# EAGLE design Adafruit AT42QT1070 Breakout (EAGLE 6.3)
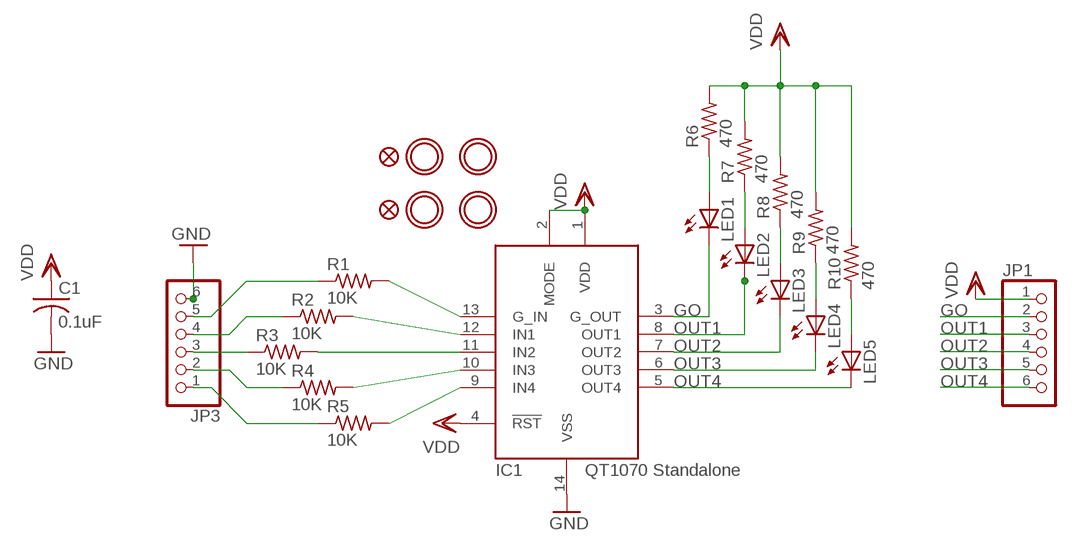
[diagram p0: schematic, sheet 1]

## Parts
C1  0.1uF  C-USC0805K  [C0805K]
FID1  FIDUCIAL""  [FIDUCIAL_1MM]
FID2  FIDUCIAL""  [FIDUCIAL_1MM]
IC1  AT42QT1070-SSU  [SO14]
JP1  PINHD-1X6CB  [1X06-CLEANBIG]
JP3  PINHD-1X6CB  [1X06-CLEANBIG]
LED1  LEDCHIP-LED0805  [CHIP-LED0805]
LED2  LEDCHIP-LED0805  [CHIP-LED0805]
LED3  LEDCHIP-LED0805  [CHIP-LED0805]
LED4  LEDCHIP-LED0805  [CHIP-LED0805]
LED5  LEDCHIP-LED0805  [CHIP-LED0805]
R1  10K  R-US_R0805  [R0805]
R2  10K  R-US_R0805  [R0805]
R3  10K  R-US_R0805  [R0805]
R4  10K  R-US_R0805  [R0805]
R5  10K  R-US_R0805  [R0805]
R6  470  R-US_R0805  [R0805]
R7  470  R-US_R0805  [R0805]
R8  470  R-US_R0805  [R0805]
R9  470  R-US_R0805  [R0805]
R10  470  R-US_R0805  [R0805]
U$1  MOUNTINGHOLE2.5  [MOUNTINGHOLE_2.5_PLATED]
U$2  MOUNTINGHOLE2.5  [MOUNTINGHOLE_2.5_PLATED]
U$3  MOUNTINGHOLE2.5  [MOUNTINGHOLE_2.5_PLATED]
U$4  MOUNTINGHOLE2.5  [MOUNTINGHOLE_2.5_PLATED]

## Nets
GND: C1.2 IC1.14(VSS) JP3.6
GO: IC1.3(G_OUT) JP1.2 LED1.C
N$1: IC1.13(G_IN) R1.2
N$2: IC1.12(IN1) R2.2
N$3: IC1.11(IN2) R3.2
N$4: IC1.10(IN3) R4.2
N$5: IC1.9(IN4) R5.2
N$6: JP3.5 R1.1
N$7: JP3.4 R2.1
N$8: JP3.3 R3.1
N$9: JP3.2 R4.1
N$10: JP3.1 R5.1
N$11: LED1.A R6.1
N$12: LED2.A R7.1
N$13: LED3.A R8.1
N$14: LED4.A R9.1
N$15: LED5.A R10.1
OUT1: IC1.8(OUT1) JP1.3 LED2.C
OUT2: IC1.7(OUT2) JP1.4 LED3.C
OUT3: IC1.6(OUT3) JP1.5 LED4.C
OUT4: IC1.5(OUT4) JP1.6 LED5.C
VDD: C1.1 IC1.1(VDD) IC1.2(MODE) IC1.4(!RST) JP1.1 R6.2 R7.2 R8.2 R9.2 R10.2

## Library data of the parts
C1 = rcl:C-US: CAPACITOR, American symbol
FID1 FID2 = microbuilder:FIDUCIAL: Fiducial Alignment Points Various fiducial points for machine vision alignment.
IC1 = adafruit:AT42QT1070: QTouch 5-channel standalone sensor IC AT42QT1070 in standalone mode has 5 inputs (guard + 4 key) and open drain outputs. 1.8V-5.5V power.
JP1 JP3 = adafruit:PINHD-1X6: PIN HEADER
LED1-LED5 = led:LED: LED OSRAM: - CHIPLED LG R971, LG N971, LY N971, LG Q971, LY Q971, LO R971, LY R971 LH N974, LH R974 LS Q976, LO Q976, LY Q976 LO Q996 - Hyper CHIPLED LW Q18S LB Q993, LB Q99A, LB R99A - SideLED LS A670, LO A670, LY A670, LG A670, LP A670 LB A673, LV A673, LT A673, LW A673 LH A674 LY A675 LS A676, LA A676, LO A676, LY A676, LW A676 LS A679, LY A679, LG A679 - Hyper Micro SIDELED® LS Y876, LA Y876, LO Y876, LY Y876 LT Y87S - SmartLED LW L88C, LW L88S LB L89C, LB L89S, LG L890 LS L89K, LO L89K, LY L89K LS L896, LA L896, LO L896, LY L896 - TOPLED LS T670, LO T670, LY T670, LG T670, LP T670 LSG T670, LSP T670, LSY T670, LOP T670, LYG T670 LG T671, LOG T671, LSG T671 LB T673, LV T673, LT T673, LW T673 LH T674 LS T676, LA T676, LO T676, LY T676, LB T676, LH T676, LSB T676, LW T676 LB T67C, LV T67C, LT T67C, LS T67K, LO T67K, LY T67K, LW E67C LS E67B, LA E67B, LO E67B, LY E67B, LB E67C, LV E67C, LT E67C LW T67C LS T679, LY T679, LG T679 LS T770, LO T770, LY T770, LG T770, LP T770 LB T773, LV T773, LT T773, LW T773 LH T774 LS E675, LA E675, LY E675, LS T675 LS T776, LA T776, LO T776, LY T776, LB T776 LHGB T686 LT T68C, LB T68C - Hyper Mini TOPLED® LB M676 - Mini TOPLED Santana® LG M470 LS M47K, LO M47K, LY M47K Source: http://www.osram.convergy.de LUXEON: - LUMILED® LXK2-PW12-R00, LXK2-PW12-S00, LXK2-PW14-U00, LXK2-PW14-V00 LXK2-PM12-R00, LXK2-PM12-S00, LXK2-PM14-U00 LXK2-PE12-Q00, LXK2-PE12-R00, LXK2-PE12-S00, LXK2-PE14-T00, LXK2-PE14-U00 LXK2-PB12-K00, LXK2-PB12-L00, LXK2-PB12-M00, LXK2-PB14-N00, LXK2-PB14-P00, LXK2-PB14-Q00 LXK2-PR12-L00, LXK2-PR12-M00, LXK2-PR14-Q00, LXK2-PR14-R00 LXK2-PD12-Q00, LXK2-PD12-R00, LXK2-PD12-S00 LXK2-PH12-R00, LXK2-PH12-S00 LXK2-PL12-P00, LXK2-PL12-Q00, LXK2-PL12-R00 Source: www.luxeon.com KINGBRIGHT: KA-3528ASYC Source: www.kingbright.com
R1-R10 = rcl:R-US_: RESISTOR, American symbol
U$1-U$4 = microbuilder:MOUNTINGHOLE: Mounting Hole For #2 screws (0.086"/2.18mm width, 0.094"/2.4mm hole) use 2.5mm

## Board
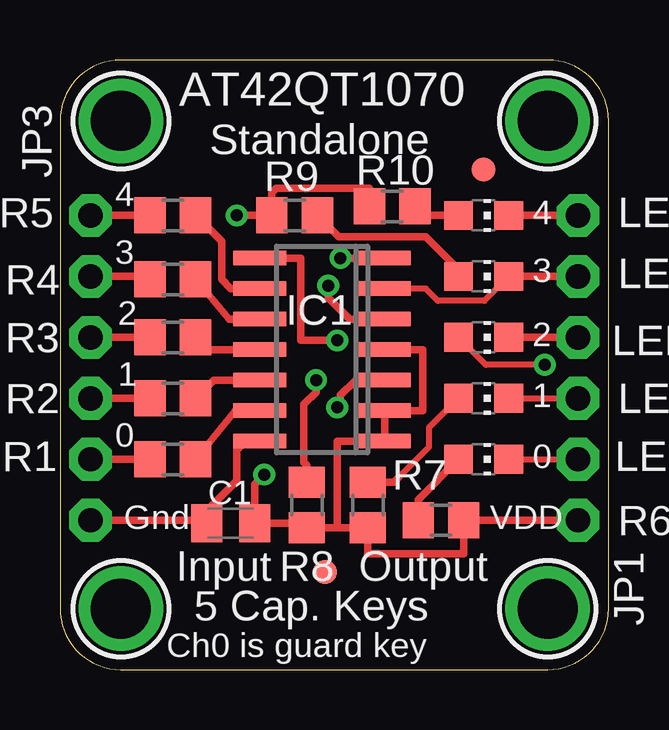
[diagram p1: board, top side]
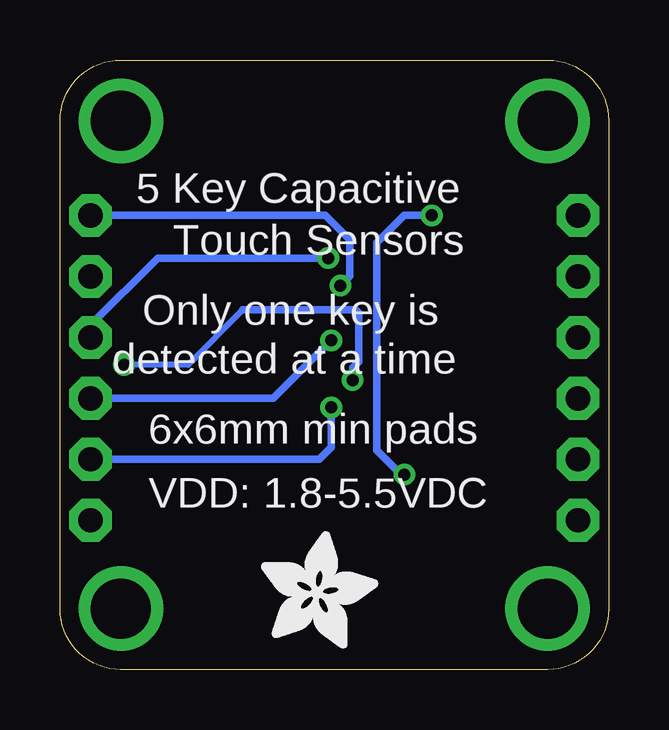
[diagram p2: board, bottom side, seen from below]

Size 22.86 x 25.4 mm. Coordinates in mm from the lower left corner, seen from the top.
Outline: 0,22.86 0,2.54 arc90 2.54,0 20.32,0 arc90 22.86,2.54 22.86,22.86 arc90 20.32,25.4 2.54,25.4 arc90 0,22.86
Copper layers (1*16): Top 0.035mm / dielectric 1.5mm / Bottom 0.035mm
Design rules "adafruit *": minimum track width 8mil, minimum drill 16mil, track to track 8mil, track to pad 8mil, pad to pad 8mil, via to via 8mil, smd to smd 8mil, copper to edge 10mil, drill to drill 8mil, minimum pad ring 10mil, minimum via ring 8mil, stop-mask expansion 4mil, vias tented up to drill 20mil, thermal gap 10mil

### Footprints (pad centres in the part's own frame; a part is rotated, then mirrored left to right if it is on the bottom)
C0805K = smd 1.3 x 1.6: 1 -1,0; 2 1,0
FIDUCIAL_1MM = smd 1 x 1: 1 0,0
SO14 = smd 0.6 x 2.2: 1 -3.81,-2.6; 2 -2.54,-2.6; 3 -1.27,-2.6; 4 0,-2.6; 5 1.27,-2.6; 6 2.54,-2.6; 7 3.81,-2.6; 8 3.81,2.6; 9 2.54,2.6; 10 1.27,2.6; 11 0,2.6; 12 -1.27,2.6; 13 -2.54,2.6; 14 -3.81,2.6
1X06-CLEANBIG = drill 1.016 pad 1.778 octagon: 1 -6.35,0; 2 -3.81,0; 3 -1.27,0; 4 1.27,0; 5 3.81,0; 6 6.35,0
CHIP-LED0805 = smd 1.2 x 1.2: A 0,-1.05; C 0,1.05
R0805 = smd 1.3 x 1.5: 1 -0.95,0; 2 0.95,0
MOUNTINGHOLE_2.5_PLATED = drill 2.5 pad 3.2: P$1 0,0

### Placement (x,y rotation side)
C1  7.11,6.1 180 top
FID1  17.65,20.83 0 top
FID2  11.05,4.06 0 top
IC1  10.92,13.34 90 top
JP1  21.59,12.57 90 top
JP3  1.27,12.57 270 top
LED1  17.65,8.76 270 top
LED2  17.65,11.3 270 top
LED3  17.65,13.84 270 top
LED4  17.65,16.38 270 top
LED5  17.65,18.92 270 top
R1  4.7,8.76 0 top
R2  4.7,11.3 0 top
R3  4.7,13.84 0 top
R4  4.7,16.26 0 top
R5  4.7,18.92 0 top
R6  15.88,6.22 0 top
R7  12.83,6.86 270 top
R8  10.29,6.86 270 top
R9  9.78,18.92 180 top
R10  13.84,19.3 180 top
U$1  2.54,22.86 0 top
U$2  20.32,22.86 0 top
U$3  2.54,2.54 0 top
U$4  20.32,2.54 0 top
U$6  [ADAFRUIT_5MM]  14.48,0.89 0 bottom

### Tracks (layer width: path | path; a pad name or v marks a point on that pad's centre or on a via)
GND
  Top 0.305: 8.51,9.53 IC1.14 7.75,9.53 7.37,9.14 7.37,7.87 6.22,6.73 6.22,6.21 C1.2 6.11,6.22 JP3.6
GO  (via drill 0.5)
  Top 0.254: LED1.C JP1.2
  Top 0.305: IC1.3 12.32,12.06 11.68,11.43 11.68,11.05 v11.56,10.92
  Bottom 0.305: 21.08,8.73 21.12,8.76 JP1.2 | 21.46,8.64 JP1.2 | v11.56,10.92 11.56,9.27 12.06,8.76 JP1.2
N$1
  Top 0.305: IC1.13 7.3,10.79 R1.2
N$2
  Top 0.305: IC1.12 6.41,12.06 R2.2
N$3
  Top 0.305: R3.2 6.16,13.34 IC1.11
N$4
  Top 0.305: IC1.10 7.05,14.61 R4.2
N$5
  Top 0.305: IC1.9 7.11,15.88 6.73,16.26 6.73,17.84 R5.2
N$6
  Top 0.305: R1.1 JP3.5
N$7
  Top 0.305: R2.1 JP3.4
N$8
  Top 0.305: R3.1 JP3.3
N$9
  Top 0.305: JP3.2 3.62,16.38 R4.1
N$10
  Top 0.305: R5.1 JP3.1
N$11
  Top 0.305: LED1.A 14.92,7.08 R6.1
N$12
  Top 0.254: LED2.A 15.37,10.07 15.37,9.27 14.1,8
  Top 0.305: 14.1,8 13.9,7.81 R7.1
N$13  (via drill 0.5)
  Top 0.254: v20.19,12.7 17.75,12.7 LED3.A
  Top 0.305: v10.67,12.06 10.67,11.56 10.16,11.05 10.16,8.64 10.29,8.51 R8.1
  Bottom 0.254: 15.24,14.99 17.53,12.7 v20.19,12.7
  Bottom 0.305: 15.24,14.99 10.54,14.99 10.41,14.86 10.41,12.83 10.67,12.57 v10.67,12.06
N$14
  Top 0.305: R9.1 11.62,18.03 15.24,18.03 16.6,16.67 LED4.A
N$15
  Top 0.305: R10.1 15.17,18.92 LED5.A
OUT1  (via drill 0.5)
  Top 0.254: LED2.C JP1.3
  Top 0.305: IC1.8 10.03,17.14 10.03,13.72 v11.56,13.72
  Bottom 0.305: JP1.3 13.97,11.3 v11.56,13.72
OUT2  (via drill 0.5)
  Top 0.305: IC1.7 v11.68,17.14 | LED3.C JP1.4
  Bottom 0.305: v11.68,17.14 18.8,17.14 21.59,14.35 JP1.4
OUT3
  Top 0.254: LED4.C 17.69,15.37 15.75,15.37 15.24,15.88 IC1.6
  Top 0.305: LED4.C JP1.5
OUT4  (via drill 0.5)
  Top 0.305: IC1.5 12.06,14.61 11.18,15.49 v11.18,16 | LED5.C JP1.6
  Bottom 0.305: JP1.6 11.81,18.92 10.79,17.91 10.79,16.38 v11.18,16
VDD  (via drill 0.5)
  Top 0.305: IC1.4 15.11,13.34 15.11,10.79 IC1.2 IC1.1 11.56,9.53 11.56,5.91 | R10.2 12.89,20.07 9.02,20.07 8.83,19.88 R9.2 v7.37,18.92 | JP1.1 R6.2 16.82,4.83 12.83,4.83 R7.2 11.56,5.91 | 11.56,5.91 R8.2 10.1,6.1 C1.1 8.11,7.73 v8.51,8.13
  Bottom 0.305: v7.37,18.92 8.51,18.92 9.65,17.78 9.65,9.14 8.64,8.13 v8.51,8.13

### Text on the board
tPlace: AT42QT1070 | Standalone | 4 | 4 | 3 | 3 | 2 | 2 | 1 | 1 | 0 | 0 | Gnd | VDD | Input | Output | 5 Cap. Keys | Ch0 is guard key
bPlace: 5 Key Capacitive | Touch Sensors | Only one key is | detected at a time | 6x6mm min pads | VDD: 1.8-5.5VDC